# Altium schematic sheet BatteryIot.SchDoc
size A4
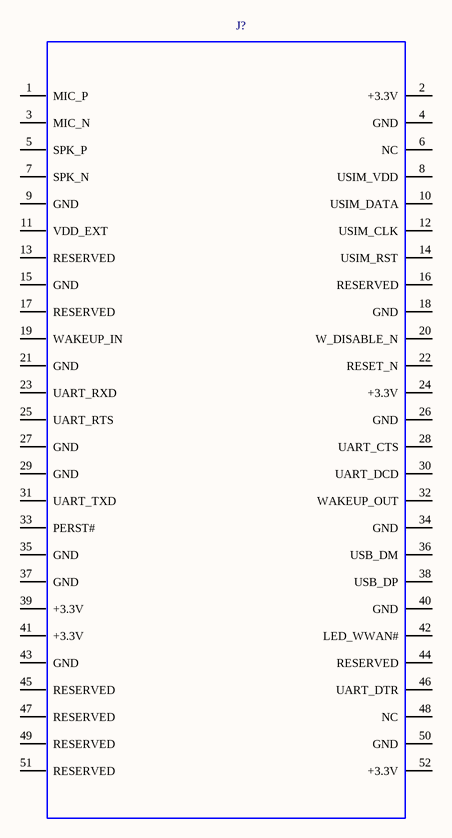
[diagram p0: BatteryIot.SchDoc]

## Parts
J?  MINI-PCIE-CON  [MINI-PCIE-CON]  (value not drawn)

## Nets
GND: J?.55(GND) J?.56(GND)

Not connected (* = marked no-connect by the designer): J? 1(MIC_P) 2(+3.3V) 3(MIC_N) 4(GND) 5(SPK_P) 6(NC) 7(SPK_N) 8(USIM_VDD) 9(GND) 10(USIM_DATA) 11(VDD_EXT) 12(USIM_CLK) 13(RESERVED) 14(USIM_RST) 15(GND) 16(RESERVED) 17(RESERVED) 18(GND) 19(WAKEUP_IN) 20(W_DISABLE_N) 21(GND) 22(RESET_N) 23(UART_RXD) 24(+3.3V) 25(UART_RTS) 26(GND) 27(GND) 28(UART_CTS) 29(GND) 30(UART_DCD) 31(UART_TXD) 32(WAKEUP_OUT) 33(PERST#) 34(GND) 35(GND) 36(USB_DM) 37(GND) 38(USB_DP) 39(+3.3V) 40(GND) 41(+3.3V) 42(LED_WWAN#) 43(GND) 44(RESERVED) 45(RESERVED) 46(UART_DTR) 47(RESERVED) 48(NC) 49(RESERVED) 50(GND) 51(RESERVED) 52(+3.3V)

## Library data of the parts
J? = MINI-PCIE-CON: Part Description: Mini PCIe; Value: Latch for Mini PCIe  4.0H 0.8MM pitch 52 circuit with cover lead-free; PCB DECAL: MINI-PCIE-CON